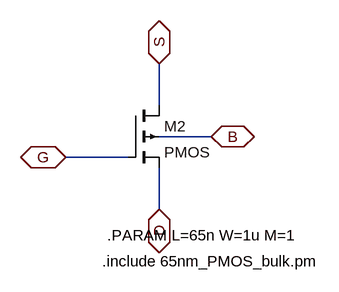
[diagram p0: schematic pmos65.asc]
pmos65.asc, the LTspice schematic file:
Version 4
SHEET 1 880 680
WIRE 160 80 160 16
WIRE 240 128 160 128
WIRE 112 160 16 160
WIRE 160 240 160 176
FLAG 16 160 G
IOPIN 16 160 BiDir
FLAG 160 240 D
IOPIN 160 240 BiDir
FLAG 160 16 S
IOPIN 160 16 BiDir
FLAG 240 128 B
IOPIN 240 128 BiDir
SYMBOL pmos4 112 80 R0
SYMATTR InstName M2
SYMATTR Value2 l={L} w={W} ad='2*65n*{W}' as='2*65n*{W}' pd='2*(2*65n+{W})' ps='2*(2*65n+{W})' m={M}
TEXT 80 280 Left 2 !.PARAM L=65n W=1u M=1
TEXT 72 320 Left 2 !.include 65nm_PMOS_bulk.pm

The netlist it stands for:
* pmos65.asc
M2 S G D B PMOS l={L} w={W} ad='2*65n*{W}' as='2*65n*{W}' pd='2*(2*65n+{W})' ps='2*(2*65n+{W})' m={M}
.model NMOS NMOS
.model PMOS PMOS
.lib standard.mos
.PARAM L=65n W=1u M=1
.include 65nm_PMOS_bulk.pm
.backanno
.end